# Altium schematic sheet 12-JLINK_1.SchDoc
size 431 x 279 mm; Organization: ORGANIZATION; Address1: ADDRESS 1; Address2: ADDRESS 2; Address3: ADDRESS 3; Address4: ADDRESS 4; DocumentNumber: 12; Revision: -; SheetNumber: 12; SheetTotal: 14; ENG_APP_DATE: --/--/--; DSN_APP_DATE: --/--/--; CHK_APP_DATE: --/--/--
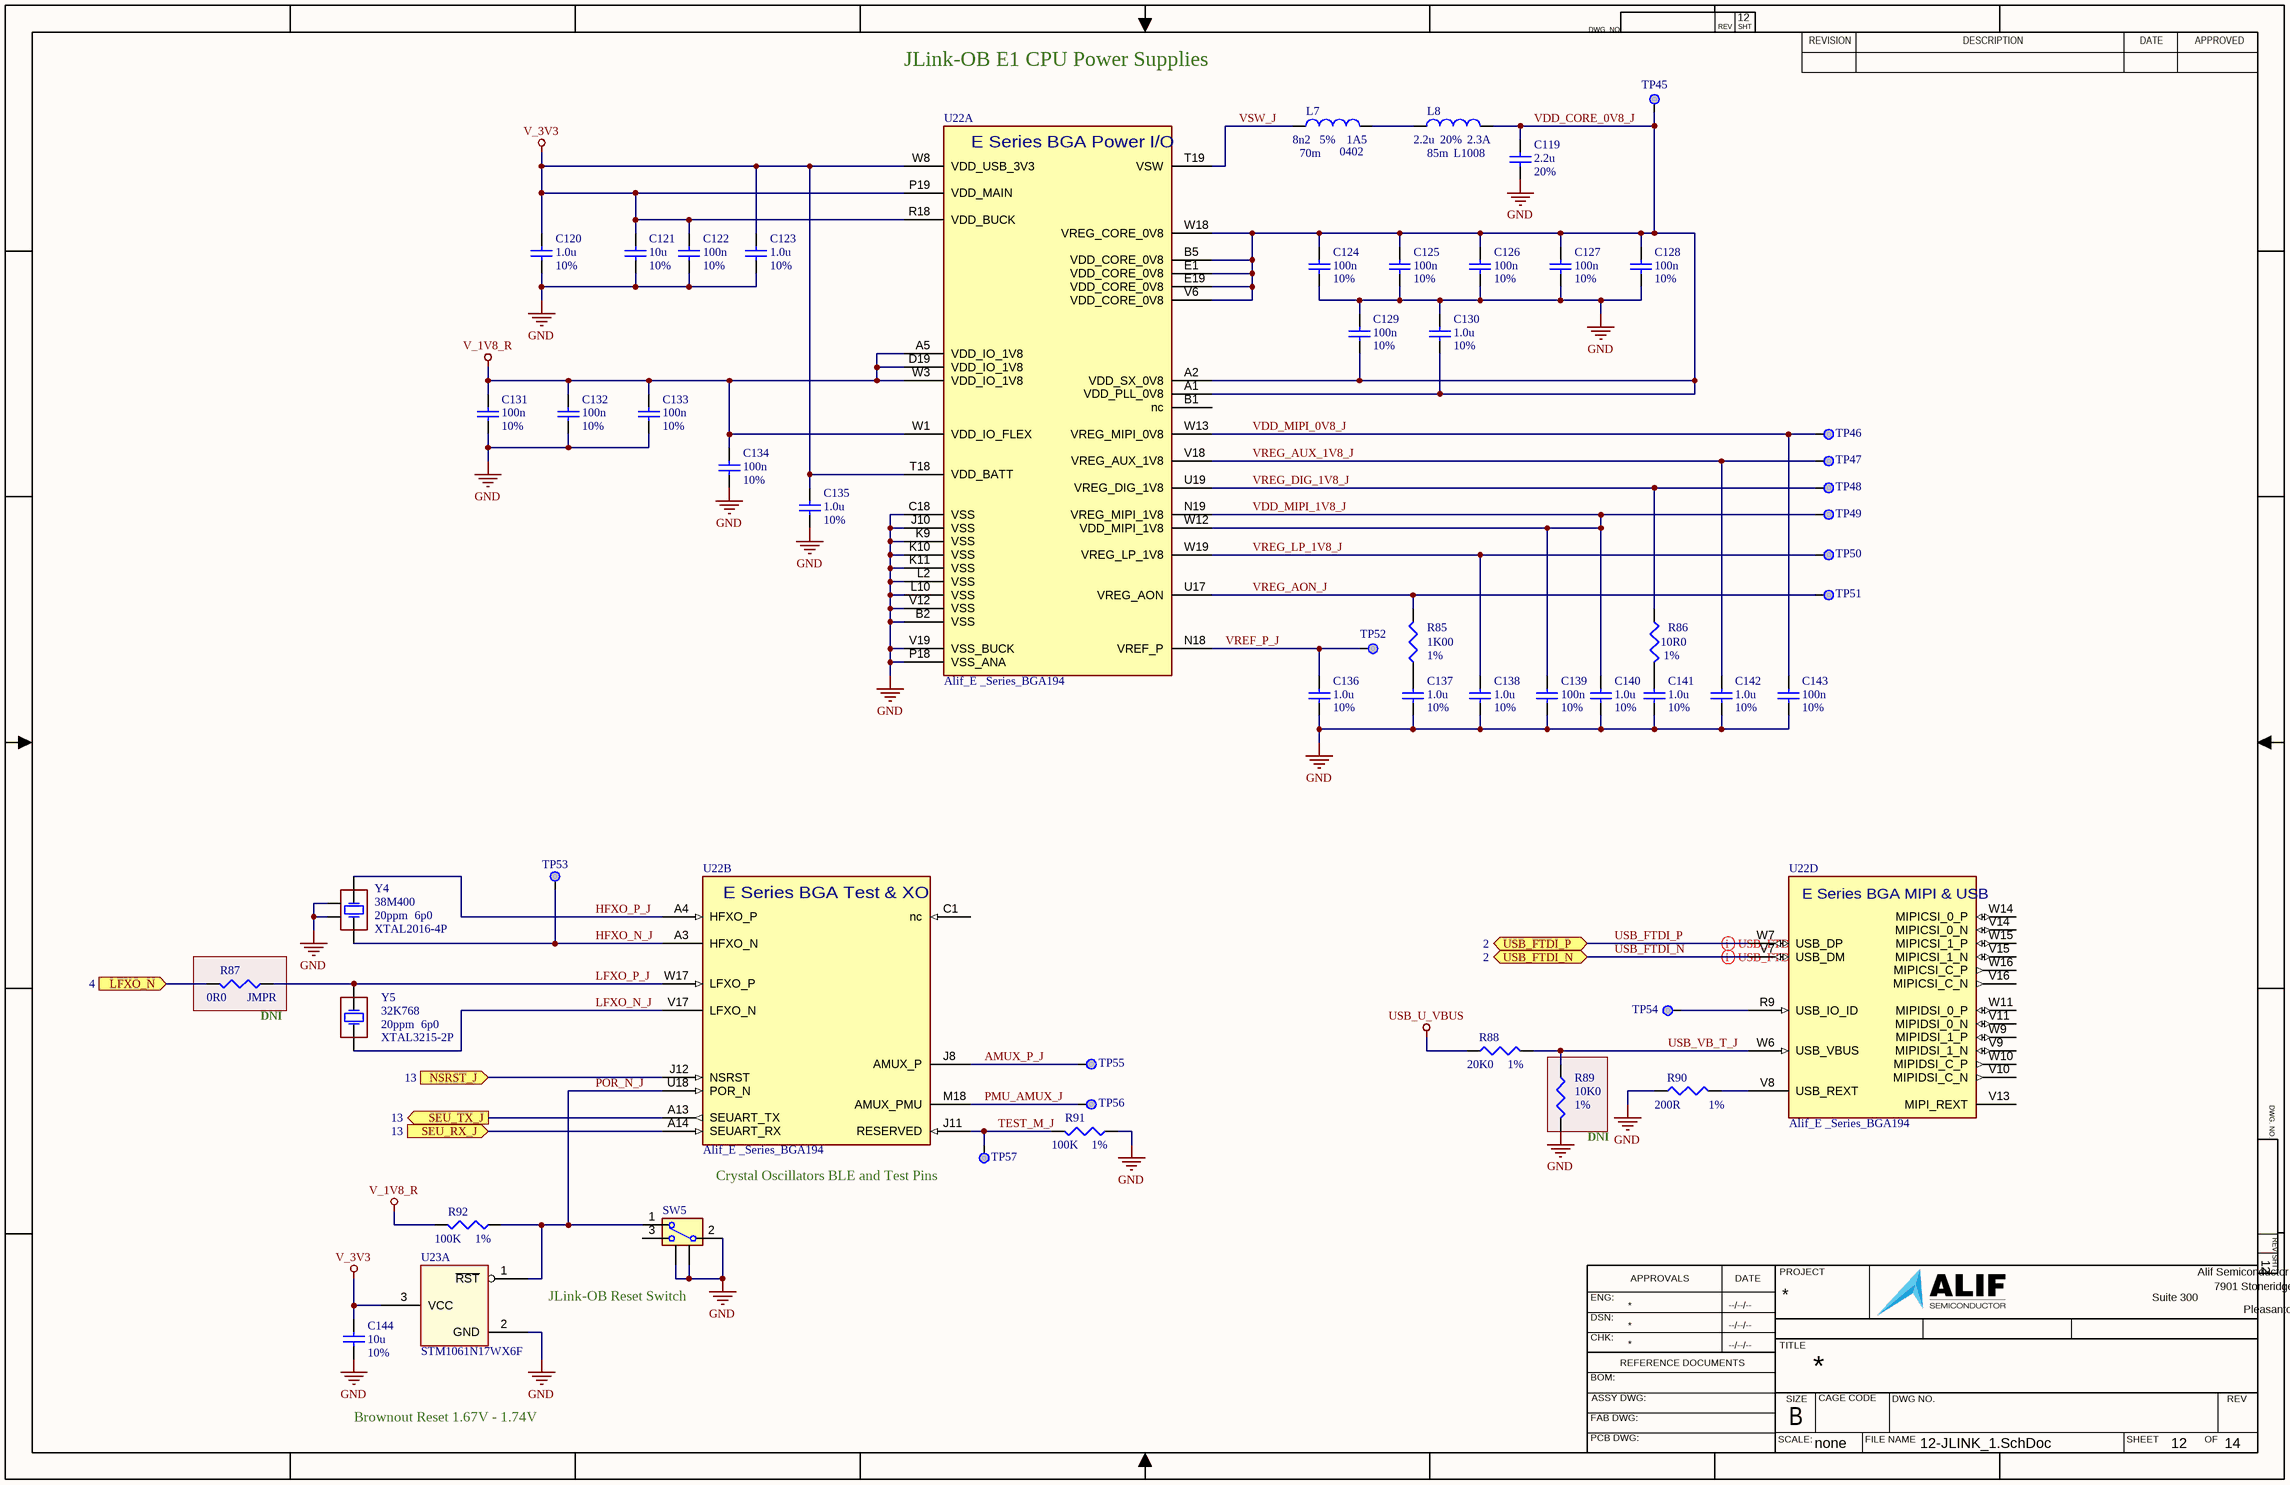
[diagram p0: 12-JLINK_1.SchDoc]

## Parts
C119  value 2.2u  Tolerance: 20%  [CAPC0402-01]  (hidden comment: Cap_225M25VX5R0402_1)
C120  value 1.0u  Tolerance: 10%  [CAPC0402-01]  (hidden comment: Cap)
C121  value 10u  Tolerance: 10%  [CAPC0402-01]  (hidden comment: Cap)
C122  value 100n  Tolerance: 10%  [CAPC0402-01]  (hidden comment: Cap)
C123  value 1.0u  Tolerance: 10%  [CAPC0402-01]  (hidden comment: Cap)
C124  value 100n  Tolerance: 10%  [CAPC0402-01]  (hidden comment: Cap)
C125  value 100n  Tolerance: 10%  [CAPC0402-01]  (hidden comment: Cap)
C126  value 100n  Tolerance: 10%  [CAPC0402-01]  (hidden comment: Cap)
C127  value 100n  Tolerance: 10%  [CAPC0402-01]  (hidden comment: Cap)
C128  value 100n  Tolerance: 10%  [CAPC0402-01]  (hidden comment: Cap)
C129  value 100n  Tolerance: 10%  [CAPC0402-01]  (hidden comment: Cap)
C130  value 1.0u  Tolerance: 10%  [CAPC0402-01]  (hidden comment: Cap)
C131  value 100n  Tolerance: 10%  [CAPC0402-01]  (hidden comment: Cap)
C132  value 100n  Tolerance: 10%  [CAPC0402-01]  (hidden comment: Cap)
C133  value 100n  Tolerance: 10%  [CAPC0402-01]  (hidden comment: Cap)
C134  value 100n  Tolerance: 10%  [CAPC0402-01]  (hidden comment: Cap)
C135  value 1.0u  Tolerance: 10%  [CAPC0402-01]  (hidden comment: Cap)
C136  value 1.0u  Tolerance: 10%  [CAPC0402-01]  (hidden comment: Cap)
C137  value 1.0u  Tolerance: 10%  [CAPC0402-01]  (hidden comment: Cap)
C138  value 1.0u  Tolerance: 10%  [CAPC0402-01]  (hidden comment: Cap)
C139  value 100n  Tolerance: 10%  [CAPC0402-01]  (hidden comment: Cap)
C140  value 1.0u  Tolerance: 10%  [CAPC0402-01]  (hidden comment: Cap)
C141  value 1.0u  Tolerance: 10%  [CAPC0402-01]  (hidden comment: Cap)
C142  value 1.0u  Tolerance: 10%  [CAPC0402-01]  (hidden comment: Cap)
C143  value 100n  Tolerance: 10%  [CAPC0402-01]  (hidden comment: Cap)
C144  value 10u  Tolerance: 10%  [CAPC0402-01]  (hidden comment: Cap)
L7  value 8n2  PCB_Footprint: 0402  DCR: 70m  RMS_Current: 1A5  Tolerance: 5%  [IND_WE-KI_0402]  (hidden comment: Inductor)
L8  value 2.2u  PackageReference: L1008  DCR: 85m  RMS_Current: 2.3A  Tolerance: 20%  [INDC2520X120N]  (hidden comment: Inductor)
R85  value 1K00  Tolerance: 1%  [RESC0402-01]  (hidden comment: Res3)
R86  value 10R0  Tolerance: 1%  [RESC0402-01]  (hidden comment: Res3)
R87  value 0R0  Tolerance: JMPR  [RESC0402-01]  (hidden comment: Res3)
R88  value 20K0  Tolerance: 1%  [RESC0402-01]  (hidden comment: Res3)
R89  value 10K0  Tolerance: 1%  [RESC0402-01]  (hidden comment: Res3)
R90  value 200R  Tolerance: 1%  [RESC0402-01]  (hidden comment: Res3)
R91  value 100K  Tolerance: 1%  [RESC0402-01]  (hidden comment: Res3)
R92  value 100K  Tolerance: 1%  [RESC0402-01]  (hidden comment: Res3)
SW5  SPDT  [SW_SPDT_OS10201MSQN1]  (value not drawn)
TP45  TP_SMPAD  [TP_30_RND]  (value not drawn)  (no BOM)
TP46  TP_SMPAD  [TP_30_RND]  (value not drawn)  (no BOM)
TP47  TP_SMPAD  [TP_30_RND]  (value not drawn)  (no BOM)
TP48  TP_SMPAD  [TP_30_RND]  (value not drawn)  (no BOM)
TP49  TP_SMPAD  [TP_30_RND]  (value not drawn)  (no BOM)
TP50  TP_SMPAD  [TP_30_RND]  (value not drawn)  (no BOM)
TP51  TP_SMPAD  [TP_30_RND]  (value not drawn)  (no BOM)
TP52  TP_SMPAD  [TP_30_RND]  (value not drawn)  (no BOM)
TP53  TP_SMPAD  [TP_30_RND]  (value not drawn)  (no BOM)
TP54  TP_SMPAD  [TP_30_RND]  (value not drawn)  (no BOM)
TP55  TP_SMPAD  [TP_30_RND]  (value not drawn)  (no BOM)
TP56  TP_SMPAD  [TP_30_RND]  (value not drawn)  (no BOM)
TP57  TP_SMPAD  [TP_30_RND]  (value not drawn)  (no BOM)
U22  Alif_E _Series_BGA194  [BGA194 _CENTERED]  (parts A,B,D of 4)
U23  STM1061N17WX6F  [SOT-23_DBZ_TEX]  (part A of 2)
Y4  value 38M400  PCB_Footprint: XTAL2016-4P  PPM: 20ppm  Load Cap: 6p0  [OSC_4p_2016_XRCGB38M400F2P00R0]  (hidden comment: Xtal_38M4_20PPM6PF_2016-4P_1)
Y5  value 32K768  PCB_Footprint: XTAL3215-2P  PPM: 20ppm  Load Cap: 6p0  [XTAL_ABS07_ABR-M]  (hidden comment: Xtal_32K768_20PPM6PF_3215-2P_1)

## Ports
LFXO_N (in, see 4), NSRST_J (in, see 13), SEU_RX_J (in, see 13), SEU_TX_J (out, see 13), USB_FTDI_N (bidir, see 2), USB_FTDI_P (bidir, see 2)

## Nets
GND: C119.1 C120.1 C121.1 C122.1 C123.1 C124.1 C125.1 C126.1 C127.1 C128.1 C129.2 C130.2 C131.1 C132.1 C133.1 C134.1 C135.1 C136.1 C137.1 C138.1 C139.1 C140.1 C141.1 C142.1 C143.1 C144.1 R89.2 R90.1 R91.1 SW5.2(COMMON) SW5.4(G1) SW5.5(G2) U22.B2(VSS) U22.C18(VSS) U22.J10(VSS) U22.K9(VSS) U22.K10(VSS) U22.K11(VSS) U22.L2(VSS) U22.L10(VSS) U22.P18(VSS_ANA) U22.V12(VSS) U22.V19(VSS_BUCK) U23.2(GND) Y4.2 Y4.4
USB_U_VBUS: R88.1
V_1V8_R: C131.2 C132.2 C133.2 C134.2 R92.2 U22.A5(VDD_IO_1V8) U22.D19(VDD_IO_1V8) U22.W1(VDD_IO_FLEX) U22.W3(VDD_IO_1V8)
V_3V3: C120.2 C121.2 C122.2 C123.2 C135.2 C144.2 U22.P19(VDD_MAIN) U22.R18(VDD_BUCK) U22.T18(VDD_BATT) U22.W8(VDD_USB_3V3) U23.3(VCC)
AMUX_P_J: TP55.1 U22.J8(AMUX_P)
HFXO_N_J: TP53.1 U22.A3(HFXO_N) Y4.3(OSC2)
HFXO_P_J: U22.A4(HFXO_P) Y4.1(OSC1)
LFXO_N: R87.2 ; port LFXO_N
LFXO_N_J: U22.V17(LFXO_N) Y5.1(OSC1)
LFXO_P_J: R87.1 U22.W17(LFXO_P) Y5.2(OSC2)
NSRST_J: U22.J12(NSRST) ; port NSRST_J
PMU_AMUX_J: TP56.1 U22.M18(AMUX_PMU)
POR_N_J: R92.1 SW5.1(NC) U22.U18(POR_N) U23.1(~{RST})
SEU_RX_J: U22.A14(SEUART_RX) ; port SEU_RX_J
SEU_TX_J: U22.A13(SEUART_TX) ; port SEU_TX_J
TEST_M_J: R91.2 TP57.1 U22.J11(RESERVED)
USB_FTDI_N: U22.V7(USB_DM) ; port USB_FTDI_N
USB_FTDI_P: U22.W7(USB_DP) ; port USB_FTDI_P
USB_VB_T_J: R88.2 R89.1 U22.W6(USB_VBUS)
VDD_CORE_0V8_J: C119.2 C124.2 C125.2 C126.2 C127.2 C128.2 C129.1 C130.1 L8.2 TP45.1 U22.A1(VDD_PLL_0V8) U22.A2(VDD_SX_0V8) U22.B5(VDD_CORE_0V8) U22.E1(VDD_CORE_0V8) U22.E19(VDD_CORE_0V8) U22.V6(VDD_CORE_0V8) U22.W18(VREG_CORE_0V8)
VDD_MIPI_0V8_J: C143.2 TP46.1 U22.W13(VREG_MIPI_0V8)
VDD_MIPI_1V8_J: C139.2 C140.2 TP49.1 U22.N19(VREG_MIPI_1V8) U22.W12(VDD_MIPI_1V8)
VREF_P_J: C136.2 TP52.1 U22.N18(VREF_P)
VREG_AON_J: R85.2 TP51.1 U22.U17(VREG_AON)
VREG_AUX_1V8_J: C142.2 TP47.1 U22.V18(VREG_AUX_1V8)
VREG_DIG_1V8_J: R86.2 TP48.1 U22.U19(VREG_DIG_1V8)
VREG_LP_1V8_J: C138.2 TP50.1 U22.W19(VREG_LP_1V8)
VSW_J: L7.1 U22.T19(VSW)
NetC137_2: C137.2 R85.1
NetC141_2: C141.2 R86.1
NetL7_2: L7.2 L8.1
NetR90_2: R90.2 U22.V8(USB_REXT)
NetTP54_1: TP54.1 U22.R9(USB_IO_ID)

Not connected (* = marked no-connect by the designer): SW5 3(NO); U22 B1(nc) C1(nc) V9(MIPIDSI_1_N) V10(MIPIDSI_C_N) V11(MIPIDSI_0_N) V13(MIPI_REXT) V14(MIPICSI_0_N) V15(MIPICSI_1_N) V16(MIPICSI_C_N) W9(MIPIDSI_1_P) W10(MIPIDSI_C_P) W11(MIPIDSI_0_P) W14(MIPICSI_0_P) W15(MIPICSI_1_P) W16(MIPICSI_C_P)

## Layout directives
differential pair; differential pair class USB_: USB_FTDI_N, USB_FTDI_P

## Notes on the sheet
- JLink-OB E1 CPU Power Supplies
- (near R87) DNI
- (near R89) DNI
- (near TP57) Crystal Oscillators BLE and Test Pins
- JLink-OB Reset Switch
- Brownout Reset 1.67V - 1.74V
- DWG. NO.
- REV
- SHT
- REVISION
- DESCRIPTION
- DATE
- APPROVED
- ENG:
- APPROVALS
- PROJECT
- Suite 300
- Alif Semiconductor
- 7901 Stoneridge Drive
- DSN:
- CHK:
- REFERENCE DOCUMENTS
- TITLE
- Pleasanton, CA 94588  USA
- BOM:
- FAB DWG:
- PCB DWG:
- ASSY DWG:
- SCALE:
- SIZE
- B
- CAGE CODE
- FILE NAME
- DWG NO.
- SHEET
- OF
- none
- (in symbol E7_B0_194BGA, part A) E Series BGA Power I/O
- (in symbol E7_B0_194BGA, part B) E Series BGA Test & XO
- (in symbol E7_B0_194BGA, part D) E Series BGA MIPI & USB

## Library data of the parts
C119 = Cap_225M25VX5R0402_1: Cap,2.2uF,20%,25V,X5R,0402; Manufacturer 1: TDK; Manufacturer Part Number 1: C1005X5R1E225M050BC; PCB_Footprint: CC0402; Published: 8-Jun-2000; LatestRevisionDate: 17-Jul-2002; LatestRevisionNote: Re-released for DXP Platform.; PackageReference: RAD-0.3; Publisher: Altium Limited; PackageDescription: Radial Cap, Thru-Hole; 2 Leads; 0.3 in Pin Spacing; Max_Height: 0.60mm; Type: X5R; Voltage: 25V; Manufacturer 2: Murata; Manufacturer Part Number 2: GRM155R61E225ME11D; Manufacturer 3: Murata; Manufacturer Part Number 3: GRM155R61E225ME15D
C120 C123 C130 C135-C138 C140-C142 = Cap: Cap,1.0uF,20%,25V,X5R,0402; Manufacturer 1: TDK; Manufacturer Part Number 1: CGB2A1X5R1E105K033BC; PCB_Footprint: CC0402; Published: 8-Jun-2000; LatestRevisionDate: 17-Jul-2002; LatestRevisionNote: Re-released for DXP Platform.; PackageReference: RAD-0.3; Publisher: Altium Limited; PackageDescription: Radial Cap, Thru-Hole; 2 Leads; 0.3 in Pin Spacing; Max_Height: 0.60mm; Manufacturer 2: Yageo; Manufacturer Part Number 2: CC0402KRX5R8BB105; Manufacturer 3: Murata; Manufacturer Part Number 3: GRM155R61E105KA12D; Type: X5R; Voltage: 25V
C121 C144 = Cap: Cap,10uF,20%,10V,X5R,0402; Manufacturer 1: AVX; Manufacturer Part Number 1: 0402ZD106MAT2A; PCB_Footprint: CC0402; Published: 8-Jun-2000; LatestRevisionDate: 17-Jul-2002; LatestRevisionNote: Re-released for DXP Platform.; PackageReference: RAD-0.3; Publisher: Altium Limited; PackageDescription: Radial Cap, Thru-Hole; 2 Leads; 0.3 in Pin Spacing; Max_Height: 0.60mm; Manufacturer 2: Samsung; Manufacturer Part Number 2: CL05A106MP5NUNC; Manufacturer 3: Venkel; Manufacturer Part Number 3: C0402X5R100-106MNP; Type: X5R; Voltage: 10V
C122 C124-C129 C131-C134 C139 C143 = Cap: Cap,100nF,10%,50V,X7R,0402; Manufacturer 1: TDK; Manufacturer Part Number 1: C1005X7R1H104K050BE; PCB_Footprint: CC0402; Published: 8-Jun-2000; LatestRevisionDate: 17-Jul-2002; LatestRevisionNote: Re-released for DXP Platform.; PackageReference: RAD-0.3; Publisher: Altium Limited; PackageDescription: Radial Cap, Thru-Hole; 2 Leads; 0.3 in Pin Spacing; Max_Height: 0.60mm; Manufacturer 2: Samsung; Manufacturer Part Number 2: CL05B104KB54PNC; Manufacturer 3: Walsin; Manufacturer Part Number 3: 0402B104K500CT; Type: X7R; Voltage: 50V
L7 = Inductor: Ind,Unshielded,8.2nH,<5%,1.5A,<70mOhm, SRF > 4GHz, 0402; Manufacturer 1: Delta; Manufacturer Part Number 1: 0402HP-8N2EGTS; Published: 8-Jun-2000; LatestRevisionDate: 29-May-2009; LatestRevisionNote: IPC-7351 Footprint Added.; PackageReference: 0402; Publisher: Altium Limited; PackageDescription: Chip Inductor; Code_JEITA: 0402; Code_IEC: 0402; Sat_Current: *; Impedance: *; Type: *; Manufacturer 2: MuRata; Manufacturer Part Number 2: LQW15AN8N2G80D; Manufacturer 3: CoilCraft; Manufacturer Part Number 3: 0402DC-8N2XGRW; Max_Height: 0.70mm
L8 = Inductor: Ind,Unshielded,2.2uH,20%,2.3A,85mOhm,1008(2520); Manufacturer 1: MuRata; Manufacturer Part Number 1: DFE252012F-2R2M=P2; Code_IEC: 2520; Published: 8-Jun-2000; LatestRevisionDate: 29-May-2009; LatestRevisionNote: IPC-7351 Footprint Added.; Publisher: Altium Limited; PackageDescription: Chip Inductor; Code_JEITA: 2520; Sat_Current: *; Impedance: *; Type: *; Manufacturer 2: Pulse Eng; Manufacturer Part Number 2: BDHE002520122R2MQ1; Manufacturer 3: Vishay; Manufacturer Part Number 3: IHHP1008ABER2R2M01; Max_Height: 0.60mm; PCB_Footprint: L1008
R85 = Res3: Res,1K00,1%,100ppm,0402; Manufacturer 1: Stackpol; Manufacturer Part Number 1: RMCF0402FT1K; Wattage: 63mW; Published: 8-Jun-2000; LatestRevisionDate: 29-May-2009; LatestRevisionNote: IPC-7351 Footprint Added.; PackageReference: RESC0402-01; Publisher: Altium Limited; PackageDescription: Chip Resistor; Voltage: *; Type: Thick Film; Manufacturer 2: Yageo; Manufacturer Part Number 2: RC0402FR-071KL; Manufacturer 3: Bourns; Manufacturer Part Number 3: CR0402-FX-1001GLF; PCB_Footprint: RESC0402-01
R86 = Res3: Res,10R0,1%,100ppm,0402; Manufacturer 1: Vishay; Manufacturer Part Number 1: CRCW040210R0FKED; Wattage: 63mW; Published: 8-Jun-2000; LatestRevisionDate: 29-May-2009; LatestRevisionNote: IPC-7351 Footprint Added.; PackageReference: RESC0402-01; Publisher: Altium Limited; PackageDescription: Chip Resistor; Voltage: *; Type: Thick Film; Manufacturer 2: KOA; Manufacturer Part Number 2: RK73H1ETTP10R0F; Manufacturer 3: Stackpol; Manufacturer Part Number 3: RMCF0402FT10R0; PCB_Footprint: RESC0402-01
R87 = Res3: DNI,Res,0R ohm,Jumper,0402; Manufacturer 1: Stackpol; Manufacturer Part Number 1: RMCF0402ZT0R00; Wattage: 63mW; Published: 8-Jun-2000; LatestRevisionDate: 29-May-2009; LatestRevisionNote: IPC-7351 Footprint Added.; PackageReference: RESC0402-01; Publisher: Altium Limited; PackageDescription: Chip Resistor; Voltage: *; Type: Thick Film; Manufacturer 2: Yageo; Manufacturer Part Number 2: RC0402FR-070RL; Manufacturer 3: Panasonic; Manufacturer Part Number 3: ERJ-XGN0R00Y; PCB_Footprint: RESC0402-01
R88 = Res3: Res,20K0,1%,100ppm,0402; Manufacturer 1: Stackpol; Manufacturer Part Number 1: RMCF0402FT20K0; Wattage: 63mW; Published: 8-Jun-2000; LatestRevisionDate: 29-May-2009; LatestRevisionNote: IPC-7351 Footprint Added.; PackageReference: RESC0402-01; Publisher: Altium Limited; PackageDescription: Chip Resistor; Voltage: *; Type: Thick Film; Manufacturer 2: Yageo; Manufacturer Part Number 2: RC0402FR-0720KL; Manufacturer 3: Bourns; Manufacturer Part Number 3: CR0402-FX-2002GLF; PCB_Footprint: RESC0402-01
R89 = Res3: DNI,Res,10K0,1%,100ppm,0402; Manufacturer 1: Stackpol; Manufacturer Part Number 1: RMCF0402FT10K0; Wattage: 63mW; Published: 8-Jun-2000; LatestRevisionDate: 29-May-2009; LatestRevisionNote: IPC-7351 Footprint Added.; PackageReference: RESC0402-01; Publisher: Altium Limited; PackageDescription: Chip Resistor; Voltage: *; Type: Thick Film; Manufacturer 2: Yageo; Manufacturer Part Number 2: RC0402FR-0710KL; Manufacturer 3: Bourns; Manufacturer Part Number 3: CR0402-FX-1002GLF; PCB_Footprint: RESC0402-01
R90 = Res3: Res,200R,1%,100ppm,0402; Manufacturer 1: Stackpol; Manufacturer Part Number 1: RMCF0402FT220R; Wattage: 63mW; Published: 8-Jun-2000; LatestRevisionDate: 29-May-2009; LatestRevisionNote: IPC-7351 Footprint Added.; PackageReference: RESC0402-01; Publisher: Altium Limited; PackageDescription: Chip Resistor; Voltage: *; Type: Thick Film; Manufacturer 2: Yageo; Manufacturer Part Number 2: RC0402FR-07200RL; Manufacturer 3: Bourns; Manufacturer Part Number 3: CR0402-FX-2000GLF; PCB_Footprint: RESC0402-01
R91 R92 = Res3: Res,100K,1%,100ppm,0402; Manufacturer 1: Stackpol; Manufacturer Part Number 1: RMCF0402FT100K; Wattage: 63mW; Published: 8-Jun-2000; LatestRevisionDate: 29-May-2009; LatestRevisionNote: IPC-7351 Footprint Added.; PackageReference: RESC0402-01; Publisher: Altium Limited; PackageDescription: Chip Resistor; Voltage: *; Type: Thick Film; Manufacturer 2: Yageo; Manufacturer Part Number 2: RC0402FR-07100KL; Manufacturer 3: Bourns; Manufacturer Part Number 3: CR0402-FX-1003GLF; PCB_Footprint: RESC0402-01
SW5 = SW-SPDT_Vert-5P: Switch,SPDT, 12V, 50mA, Non-Shorting, 5 Pin PCB Vertical; Manufacturer 1: C&K; Manufacturer Part Number 1: OS102011MS2QN1; Value: SPDT-5Pin; Published: 24-Mar-1999; LatestRevisionDate: 17-Jul-2002; LatestRevisionNote: Re-released for DXP Platform.; PackageReference: SPDT-5; Publisher: Altium Limited; PackageDescription: Switch; 2 Leads; Manufacturer 2: C&K; Manufacturer Part Number 2: OS102011MS2QN1C; Manufacturer 3: E-Switch; Manufacturer Part Number 3: EG1249
TP45-TP57 = TP_SMPAD: Test Point, SMT Pad,--not a BOM item--; PCB_Footprint: TP_PAD1
U22 = E7_B0_194BGA: IC,Alif E1 MCU, Rev B silicon,BGA194; Manufacturer 1: Alif Semi; Manufacturer Part Number 1: AE101F4071542LH
U23 = IC_SUP_STM1061N17WX6F: IC,PMIC Volt Supervisor, -Reset OD, 1.7V, 2%, 900nA, SOT23-3; Manufacturer 1: ST Micro; Manufacturer Part Number 1: STM1061N17WX6F; Manufacturer 2: *; Manufacturer Part Number 2: *
Y4 = Xtal_38M4_20PPM6PF_2016-4P_1: Crystal,38.4MHz,20ppm,6.0pF,100ohm,2016-4pin; Manufacturer 1: Murata; Manufacturer Part Number 1: XRCGB38M400F2P00R0; ESR: 100; Published: 8-Jun-2000; LatestRevisionDate: 17-Jul-2002; LatestRevisionNote: Re-released for DXP Platform.; PackageReference: R38; Publisher: Altium Limited; PackageDescription: Crystal, Thru-Hole; 2 Leads; Body 3.1 x 8.2 mm (Dia.xH); Max_Height: 0.65mm
Y5 = Xtal_32K768_20PPM6PF_3215-2P_1: Crystal, 32.768KHz, 20ppm, 6pF, <70Kohm, 3215-2pin; Manufacturer 1: Epson; Manufacturer Part Number 1: FC-135R 32.7680KF-E; ESR: 70Kohm; Published: 8-Jun-2000; LatestRevisionDate: 17-Jul-2002; LatestRevisionNote: Re-released for DXP Platform.; PackageReference: R38; Publisher: Altium Limited; PackageDescription: Crystal, Thru-Hole; 2 Leads; Body 3.1 x 8.2 mm (Dia.xH); Max_Height: 0.60mm; Manufacturer 2: Abracon; Manufacturer Part Number 2: ABS07-32.768KHZ-6-T